# Altium schematic sheet 主机板2.SchDoc
size A4
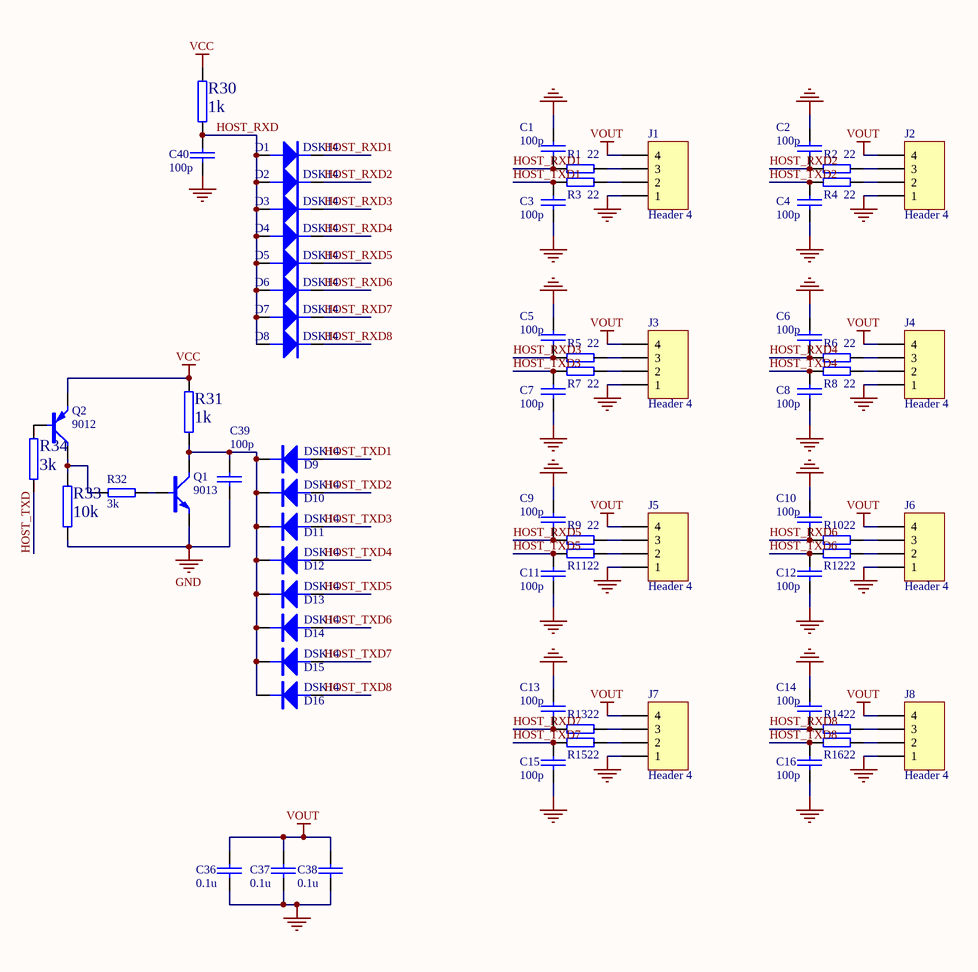
[diagram p0: 主机板2.SchDoc]

## Parts
C1  100p  [C0603]
C2  100p  [C0603]
C3  100p  [C0603]
C4  100p  [C0603]
C5  100p  [C0603]
C6  100p  [C0603]
C7  100p  [C0603]
C8  100p  [C0603]
C9  100p  [C0603]
C10  100p  [C0603]
C11  100p  [C0603]
C12  100p  [C0603]
C13  100p  [C0603]
C14  100p  [C0603]
C15  100p  [C0603]
C16  100p  [C0603]
C36  0.1u  [C0603]
C37  0.1u  [C0603]
C38  0.1u  [C0603]
C39  100p  [C0603]
C40  100p  [C0603]
D1  DSK14  [SOD-123FL]
D2  DSK14  [SOD-123FL]
D3  DSK14  [SOD-123FL]
D4  DSK14  [SOD-123FL]
D5  DSK14  [SOD-123FL]
D6  DSK14  [SOD-123FL]
D7  DSK14  [SOD-123FL]
D8  DSK14  [SOD-123FL]
D9  DSK14  [SOD-123FL]
D10  DSK14  [SOD-123FL]
D11  DSK14  [SOD-123FL]
D12  DSK14  [SOD-123FL]
D13  DSK14  [SOD-123FL]
D14  DSK14  [SOD-123FL]
D15  DSK14  [SOD-123FL]
D16  DSK14  [SOD-123FL]
J1  Header 4  [HDX4-2.54]
J2  Header 4  [HDX4-2.54]
J3  Header 4  [HDX4-2.54]
J4  Header 4  [HDX4-2.54]
J5  Header 4  [HDX4-2.54]
J6  Header 4  [HDX4-2.54]
J7  Header 4  [HDX4-2.54]
J8  Header 4  [HDX4-2.54]
Q1  9013  [SOT-23-TRAN]
Q2  9012  [SOT23-9013]
R1  22  [R0603]
R2  22  [R0603]
R3  22  [R0603]
R4  22  [R0603]
R5  22  [R0603]
R6  22  [R0603]
R7  22  [R0603]
R8  22  [R0603]
R9  22  [R0603]
R10  22  [R0603]
R11  22  [R0603]
R12  22  [R0603]
R13  22  [R0603]
R14  22  [R0603]
R15  22  [R0603]
R16  22  [R0603]
R30  1k  [r0603]
R31  1k  [r0603]
R32  3k  [R0603]
R33  10k  [r0603]
R34  3k  [r0603]

## Nets
GND: C1.1 C2.1 C3.1 C4.1 C5.1 C6.1 C7.1 C8.1 C9.1 C10.1 C11.1 C12.1 C13.1 C14.1 C15.1 C16.1 C36.1 C37.1 C38.1 C39.1 C40.1 J1.1 J2.1 J3.1 J4.1 J5.1 J6.1 J7.1 J8.1 Q1.E R33.1
VCC: Q2.1(E) R30.1 R31.1
VOUT: C36.2 C37.2 C38.2 J1.4 J2.4 J3.4 J4.4 J5.4 J6.4 J7.4 J8.4
HOST_RXD: C40.2 D1.1(A) D2.1(A) D3.1(A) D4.1(A) D5.1(A) D6.1(A) D7.1(A) D8.1(A) R30.2
HOST_RXD1: C1.2 D1.2(K) R1.1
HOST_RXD2: C2.2 D2.2(K) R2.1
HOST_RXD3: C5.2 D3.2(K) R5.1
HOST_RXD4: C6.2 D4.2(K) R6.1
HOST_RXD5: C9.2 D5.2(K) R9.1
HOST_RXD6: C10.2 D6.2(K) R10.1
HOST_RXD7: C13.2 D7.2(K) R13.1
HOST_RXD8: C14.2 D8.2(K) R14.1
HOST_TXD: R34.1
HOST_TXD1: C3.2 D9.1(A) R3.2
HOST_TXD2: C4.2 D10.1(A) R4.2
HOST_TXD3: C7.2 D11.1(A) R7.2
HOST_TXD4: C8.2 D12.1(A) R8.2
HOST_TXD5: C11.2 D13.1(A) R11.2
HOST_TXD6: C12.2 D14.1(A) R12.2
HOST_TXD7: C15.2 D15.1(A) R15.2
HOST_TXD8: C16.2 D16.1(A) R16.2
NetC39_2: C39.2 D9.2(K) D10.2(K) D11.2(K) D12.2(K) D13.2(K) D14.2(K) D15.2(K) D16.2(K) Q1.C R31.2
NetJ1_2: J1.2 R3.1
NetJ1_3: J1.3 R1.2
NetJ2_2: J2.2 R4.1
NetJ2_3: J2.3 R2.2
NetJ3_2: J3.2 R7.1
NetJ3_3: J3.3 R5.2
NetJ4_2: J4.2 R8.1
NetJ4_3: J4.3 R6.2
NetJ5_2: J5.2 R11.1
NetJ5_3: J5.3 R9.2
NetJ6_2: J6.2 R12.1
NetJ6_3: J6.3 R10.2
NetJ7_2: J7.2 R15.1
NetJ7_3: J7.3 R13.2
NetJ8_2: J8.2 R16.1
NetJ8_3: J8.3 R14.2
NetQ1_B: Q1.B R32.1
NetQ2_2: Q2.2(B) R34.2
NetQ2_3: Q2.3(C) R32.2 R33.2

## Library data of the parts
C1-C16 C36-C40 = CAP: 无极性电容
D1-D16 = DIODE: 二极管，Diode
J1-J8 = Header 4: Header, 4-Pin; LatestRevisionDate: 17-Jul-2002; LatestRevisionNote: Re-released for DXP Platform.; Publisher: Altium Limited
Q1 = NPN-S: NPN Transistor
R1-R16 R32 = RES
R30 R31 R33 R34 = RES2